# Altium schematic sheet sense_misc.SchDoc: Sense Miscellaneous
size A4; Date: 27.05.2014; Author: Stefan Lüthi; DrawnBy: Stefan Lüthi; Organization: BFH; Address1: Bern University of Applied Sciences; Address2: Engineering and Information Technology; Address3: Jlcoweg 1; Address4: CH-3400 Burgdorf; DocumentNumber: 1; Revision: 1.0; SheetNumber: 5; SheetTotal: 8; CurrentDate: 27.05.2014
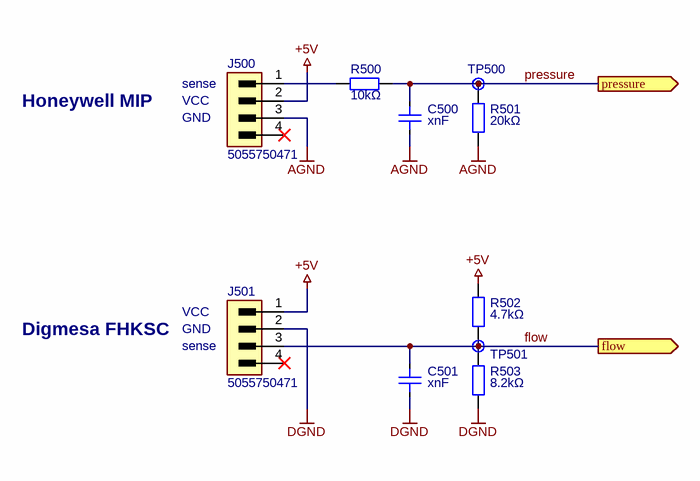
[diagram p0: sense_misc.SchDoc]

## Parts
C500  xnF  [SMD0603CAP]
C501  xnF  [SMD0603CAP]
J500  5055750471  [5055750471]
J501  5055750471  [5055750471]
R500  10kΩ  [SMD0603RES]
R501  20kΩ  [SMD0603RES]
R502  4.7kΩ  [SMD0603RES]
R503  8.2kΩ  [SMD0603RES]
TP500  Testpoint  [TP]  (value not drawn)  (no BOM)
TP501  Testpoint  [TP]  (value not drawn)  (no BOM)

## Ports
flow (out), pressure (out)

## Nets
+5V: J500.2 J501.1 R502.1
AGND: C500.2 J500.3 R501.2
DGND: C501.2 J501.2 R503.2
flow: C501.1 J501.3 R502.2 R503.1 TP501.1 ; port flow
pressure: C500.1 R500.1 R501.1 TP500.1 ; port pressure
NetJ500_1: J500.1 R500.2

Not connected (* = marked no-connect by the designer): J500 4*; J501 4*

## Notes on the sheet
- Honeywell MIP
- VCC
- GND
- (near J500) sense
- Digmesa FHKSC
- (near J501) sense
- Author:
- Title:
- Number:
- Product:
- Sheet
- of
- Variant:
- Revision:
- File:
- Template:
- A4SL CC-BY-SA (07-17)

## Library data of the parts
C500 C501 = Capacitor Ceramic: Ceramic Capacitor
J500 J501 = Connector 4x1P
R500-R503 = Resistor